# EAGLE schematic DeepSix (EAGLE 9.5.2)
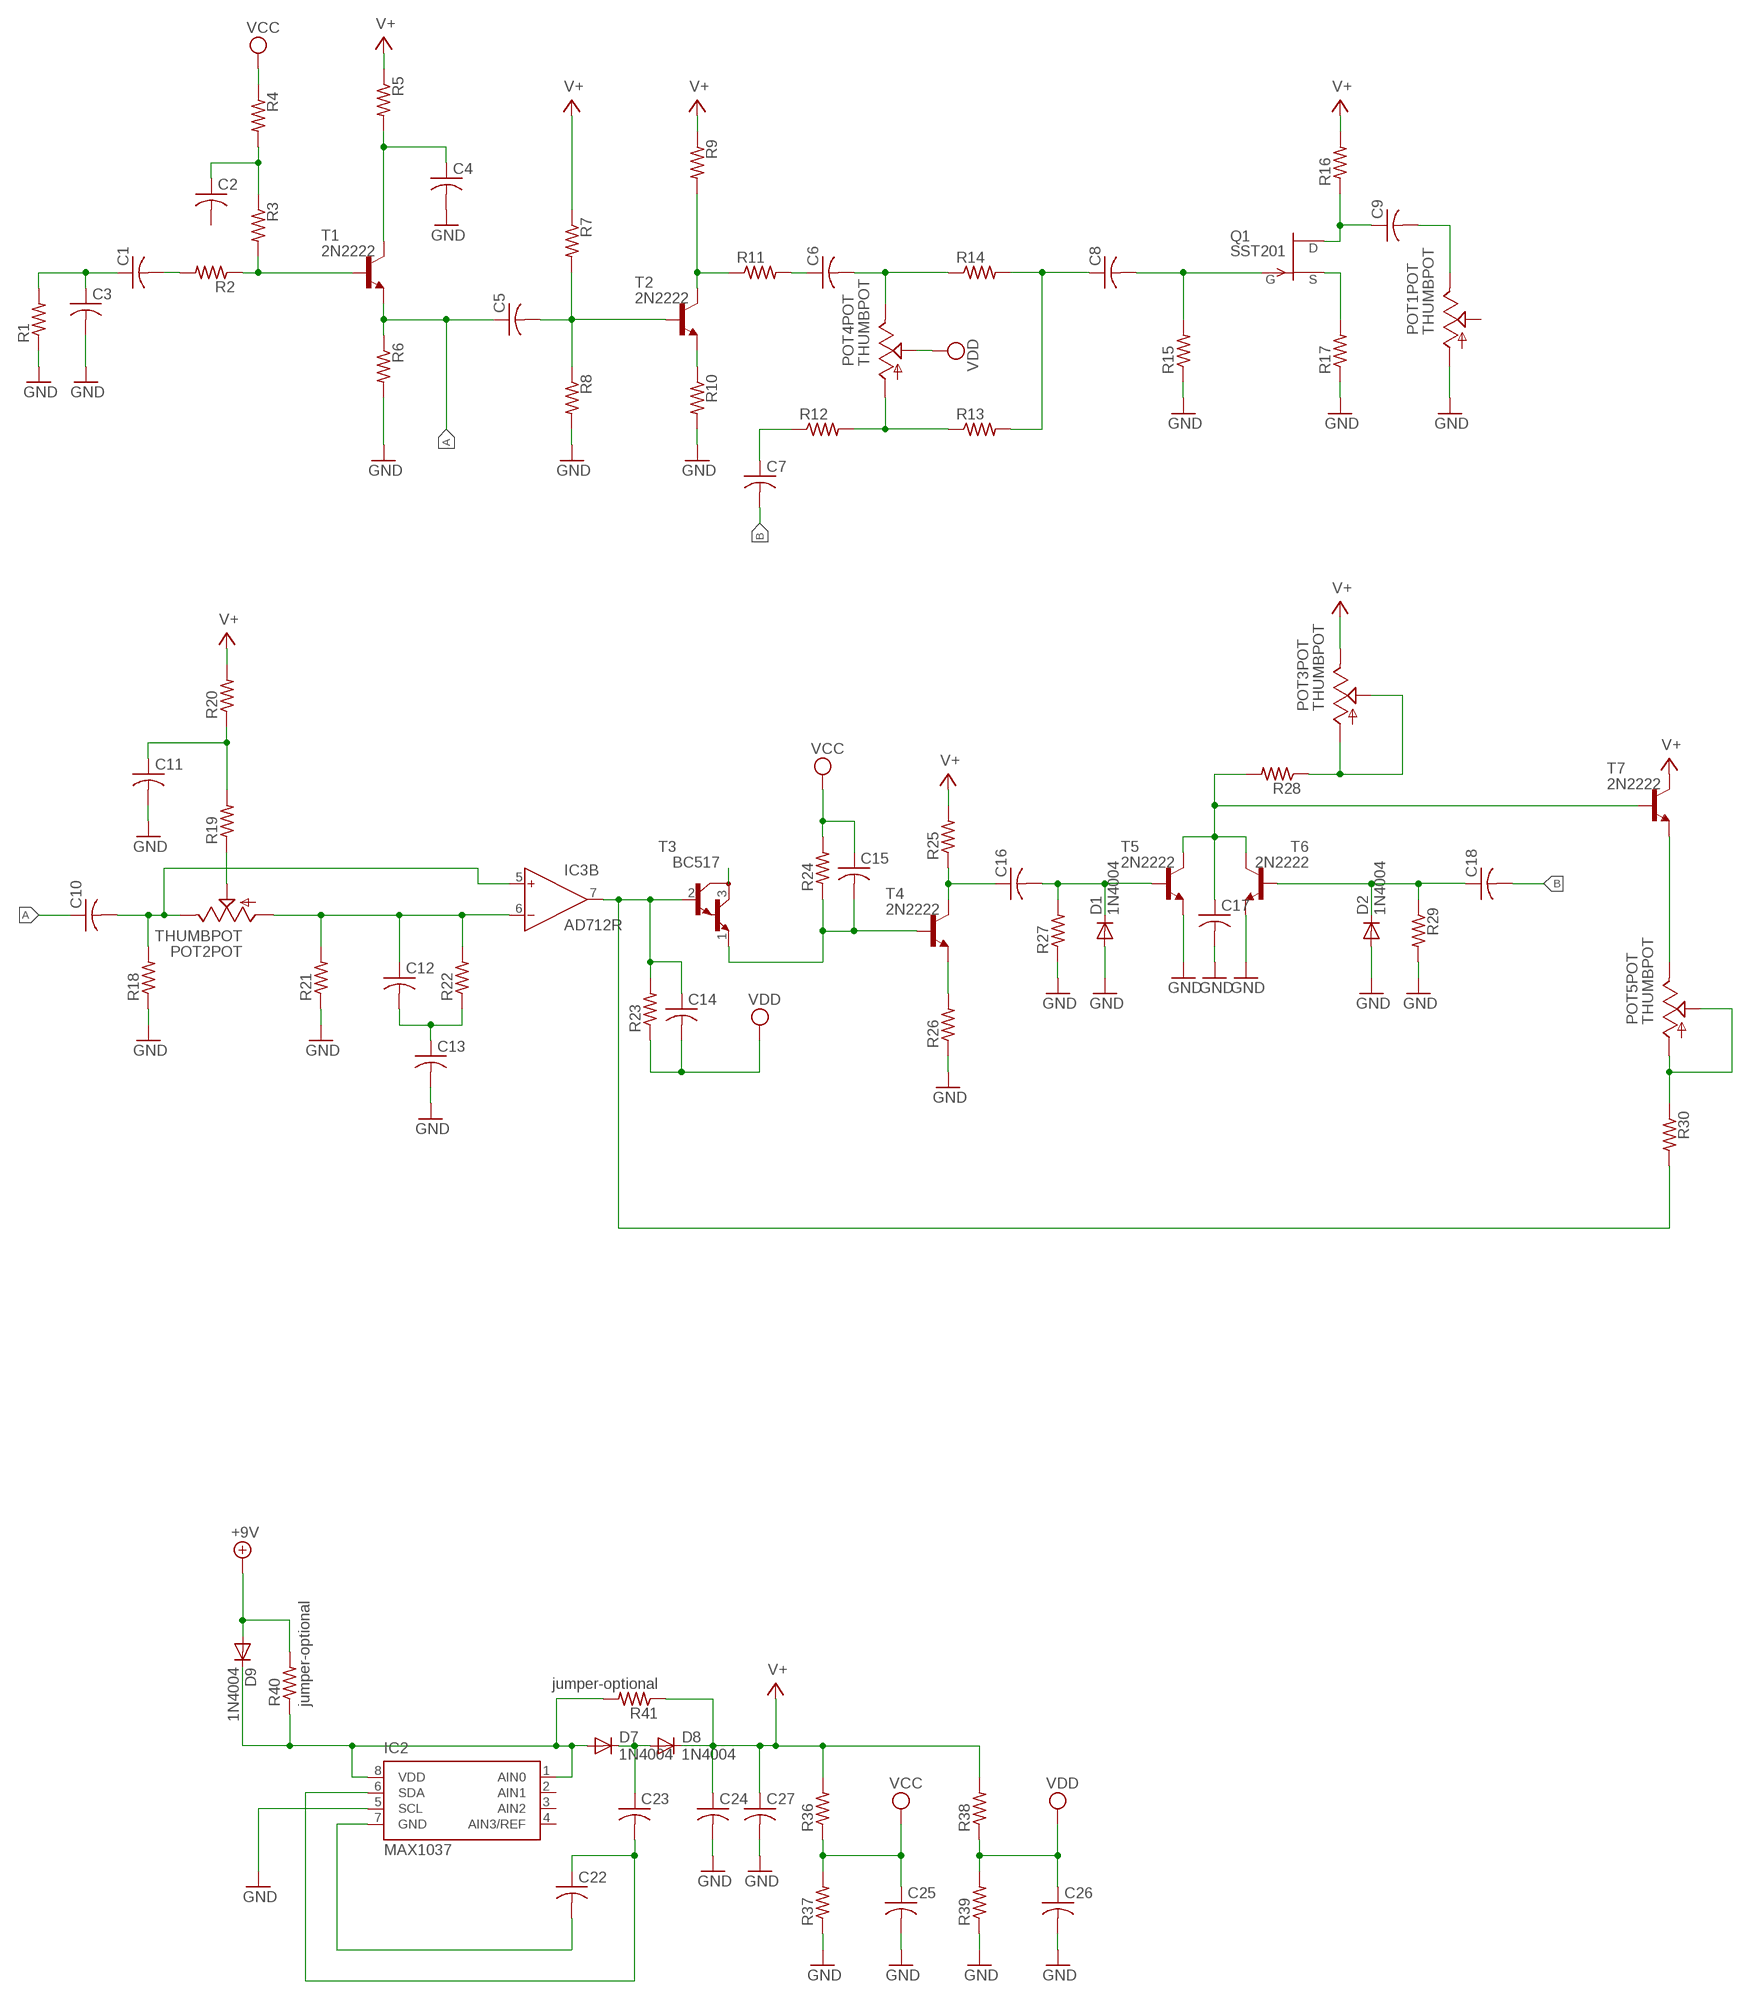
[diagram p0: schematic, sheet 1]

## Parts
C1  C-USC0603  [C0603]
C2  C-USC0603  [C0603]
C3  C-USC0603  [C0603]
C4  C-USC0603  [C0603]
C5  C-USC0603  [C0603]
C6  C-USC0603  [C0603]
C7  C-USC0603  [C0603]
C8  C-USC0603  [C0603]
C9  C-USC0603  [C0603]
C10  C-USC0603  [C0603]
C11  C-USC0603  [C0603]
C12  C-USC0603  [C0603]
C13  C-USC0603  [C0603]
C14  C-USC0603  [C0603]
C15  C-USC0603  [C0603]
C16  C-USC0603  [C0603]
C17  C-USC0603  [C0603]
C18  C-USC0603  [C0603]
C22  C-USC0603  [C0603]
C23  C-USC0603  [C0603]
C24  C-USC0603  [C0603]
C25  C-USC0603  [C0603]
C26  C-USC0603  [C0603]
C27  C-USC0603  [C0603]
D1  1N4004  [DO41-10]
D2  1N4004  [DO41-10]
D7  1N4004  [DO41-10]
D8  1N4004  [DO41-10]
D9  1N4004  [DO41-10]
IC2  MAX1037  [SOT23-8L]
IC3  AD712R  [SO8]
POT1  THUMBPOT  [THUMBWHEEL]
POT2  THUMBPOT  [THUMBWHEEL]
POT3  THUMBPOT  [THUMBWHEEL]
POT4  THUMBPOT  [THUMBWHEEL]
POT5  THUMBPOT  [THUMBWHEEL]
Q1  SST201  [SOT23]
R1  R-US_R0603  [R0603]
R2  R-US_R0603  [R0603]
R3  R-US_R0603  [R0603]
R4  R-US_R0603  [R0603]
R5  R-US_R0603  [R0603]
R6  R-US_R0603  [R0603]
R7  R-US_R0603  [R0603]
R8  R-US_R0603  [R0603]
R9  R-US_R0603  [R0603]
R10  R-US_R0603  [R0603]
R11  R-US_R0603  [R0603]
R12  R-US_R0603  [R0603]
R13  R-US_R0603  [R0603]
R14  R-US_R0603  [R0603]
R15  R-US_R0603  [R0603]
R16  R-US_R0603  [R0603]
R17  R-US_R0603  [R0603]
R18  R-US_R0603  [R0603]
R19  R-US_R0603  [R0603]
R20  R-US_R0603  [R0603]
R21  R-US_R0603  [R0603]
R22  R-US_R0603  [R0603]
R23  R-US_R0603  [R0603]
R24  R-US_R0603  [R0603]
R25  R-US_R0603  [R0603]
R26  R-US_R0603  [R0603]
R27  R-US_R0603  [R0603]
R28  R-US_R0603  [R0603]
R29  R-US_R0603  [R0603]
R30  R-US_R0603  [R0603]
R36  R-US_R0603  [R0603]
R37  R-US_R0603  [R0603]
R38  R-US_R0603  [R0603]
R39  R-US_R0603  [R0603]
R40  jumper-optional  R-US_R0603  [R0603]
R41  jumper-optional  R-US_R0603  [R0603]
T1  2N2222  [TO92-EBC-OVAL]
T2  2N2222  [TO92-EBC-OVAL]
T3  BC517  [TO92]
T4  2N2222  [TO92-EBC-OVAL]
T5  2N2222  [TO92-EBC-OVAL]
T6  2N2222  [TO92-EBC-OVAL]
T7  2N2222  [TO92-EBC-OVAL]

## Nets
+9V: D9.A R40.2
A: C5.1 C10.1 R6.1 T1.E
B: C7.2 C18.2
GND: C3.2 C4.2 C11.2 C13.2 C17.2 C24.2 C25.2 C26.2 C27.2 D1.A D2.A IC2.5(SCL) POT1.1(POT:A) R1.1 R6.2 R8.2 R10.2 R15.1 R17.1 R18.1 R21.1 R26.1 R27.1 R29.2 R37.1 R39.1 T5.E T6.E
N$1: C1.1 C3.1 R1.2
N$2: C1.2 R2.2
N$3: C2.1 R3.1 R4.2
N$4: R2.1 R3.2 T1.B
N$5: C4.1 R5.2 T1.C
N$7: C5.2 R7.2 R8.1 T2.B
N$8: R9.2 R11.1 T2.C
N$9: R10.1 T2.E
N$10: C6.1 R11.2
N$11: C6.2 POT4.3(POT:E) R14.1
N$12: POT4.1(POT:A) R12.2 R13.1
N$13: C7.1 R12.1
N$15: C8.1 R13.2 R14.2
N$16: C8.2 Q1.3(G) R15.2
N$17: C9.1 Q1.1(D) R16.1
N$18: Q1.2(S) R17.2
N$19: C9.2 POT1.3(POT:E)
N$20: C12.2 C13.1 R22.1
N$21: POT2.2(POT:S) R19.1
N$22: C11.1 R19.2 R20.1
N$23: C10.2 IC3.5(B:IN+) POT2.3(POT:E) R18.2
N$24: C12.1 IC3.6(B:IN-) POT2.1(POT:A) R21.2 R22.2
N$25: C14.1 IC3.7(B:OUT) R23.2 R30.2 T3.2(B)
N$26: C16.1 R25.1 T4.C
N$28: T3.3(C)
N$29: C15.2 R24.1 T3.1(E) T4.B
N$30: R26.2 T4.E
N$32: C16.2 D1.C R27.2 T5.B
N$33: POT3.1(POT:A) POT3.2(POT:S) R28.1
N$34: C17.1 R28.2 T5.C T6.C T7.B
N$36: C18.1 D2.C R29.1 T6.B
N$40: POT5.3(POT:E) T7.E
N$41: POT5.1(POT:A) POT5.2(POT:S) R30.1
N$49: D7.A D9.C IC2.1(AIN0) IC2.8(VDD) R40.1 R41.2
N$50: C22.2 IC2.7(GND)
N$51: C22.1 C23.2 IC2.6(SDA)
N$52: C23.1 D7.C D8.A
V+: C24.1 C27.1 D8.C POT3.3(POT:E) R5.1 R7.1 R9.1 R16.2 R20.2 R25.2 R36.2 R38.2 R41.1 T7.C
VCC: C15.1 C25.1 R4.1 R24.2 R36.1 R37.2
VDD: C14.2 C26.1 POT4.2(POT:S) R23.1 R38.1 R39.2
Unconnected: C2.2 IC2.2(AIN1) IC2.3(AIN2) IC2.4(AIN3/REF) IC3.1(A:OUT) IC3.2(A:IN-) IC3.3(A:IN+) POT1.2(POT:S) POT1.SW1(SW:S) POT1.SW2(SW:P) POT2.SW1(SW:S) POT2.SW2(SW:P) POT3.SW1(SW:S) POT3.SW2(SW:P) POT4.SW1(SW:S) POT4.SW2(SW:P) POT5.SW1(SW:S) POT5.SW2(SW:P)

## Power pins joined to a net without a drawn wire
V+: IC3.8(P:V+)
V-: IC3.4(P:V-)

## Library data of the parts
C1-C18 C22-C27 = rcl:C-US: CAPACITOR, American symbol; SPICEPREFIX: C
D1 D2 D7-D9 = adafruit:1N4004: DIODE General purpose 1N400x type rectifier (With bigger pads) http://www.ladyada.net/library/pcb/eaglelibrary.html
IC2 = maxim:MAX103*: 2.7V to 5.5V, Low-Power, 4-/12-Channel 2-Wire Serial 8-Bit ADCs Source: http://datasheets.maxim-ic.com/en/ds/MAX1036-MAX1039M.pdf; MF: MAXIM; MPN: MAX1037EKA+T; OC_FARNELL: unknown; OC_NEWARK: 68K9410
IC3 = analog-devices:AD712: Dual Precision, Low Cost, High Speed BiFET Op Amp Source: http://www.analog.com/static/imported-files/data_sheets/AD712.pdf; MF: ALTERA CORPORATION; MPN: AD712KRZ; OC_FARNELL: 1263975; OC_NEWARK: 59K4556
POT1-POT5 = adafruit:THUMBPOT: Thumbwheel pot with switch Available in horizontal (Alpha RV121SF) or vertical (Xicon 311-1701)
Q1 = transistor-fet:?20*: TEMIC / Siliconix N-Channel JFET Source: JFET-J201_Siliconix_data.pdf
R1-R30 R36-R41 = rcl:R-US_: RESISTOR, American symbol; SPICEPREFIX: R
T1 T2 T4-T7 = adafruit:2N2222: NPN TRANSISTOR Big oval pads
T3 = transistor:BC517: NPN BIPOLAR DARLINGTON TRANSISTOR